# EAGLE design PreAmpAndFilter (EAGLE 7.6.0)
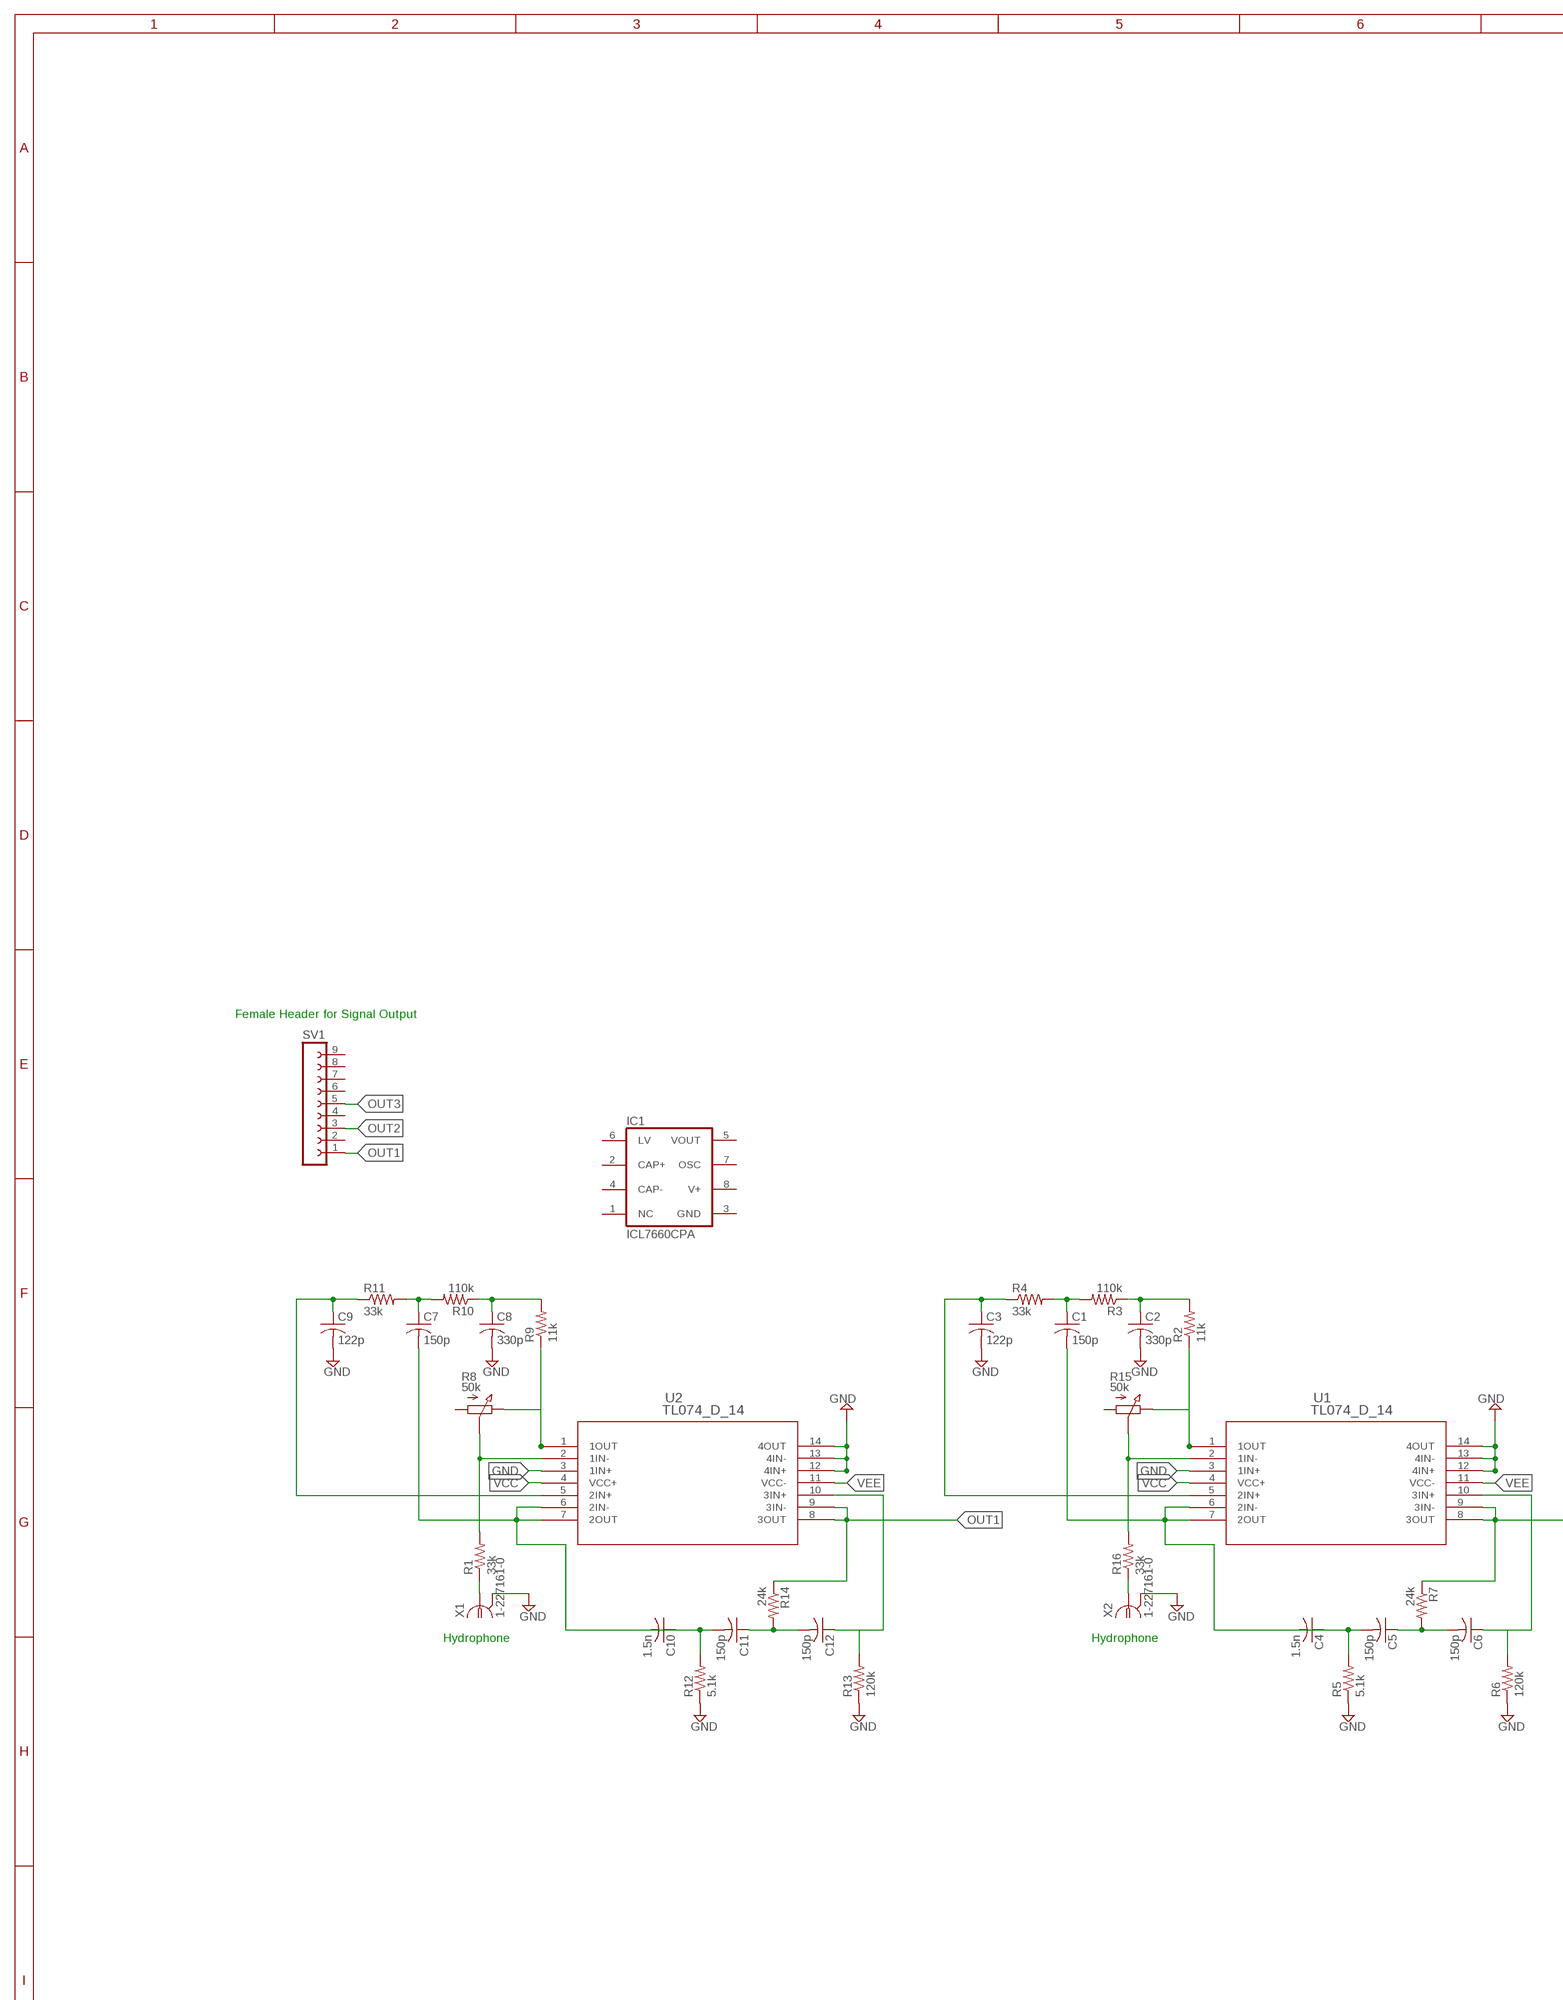
[diagram p0: schematic, sheet 1, part 1 of 2]
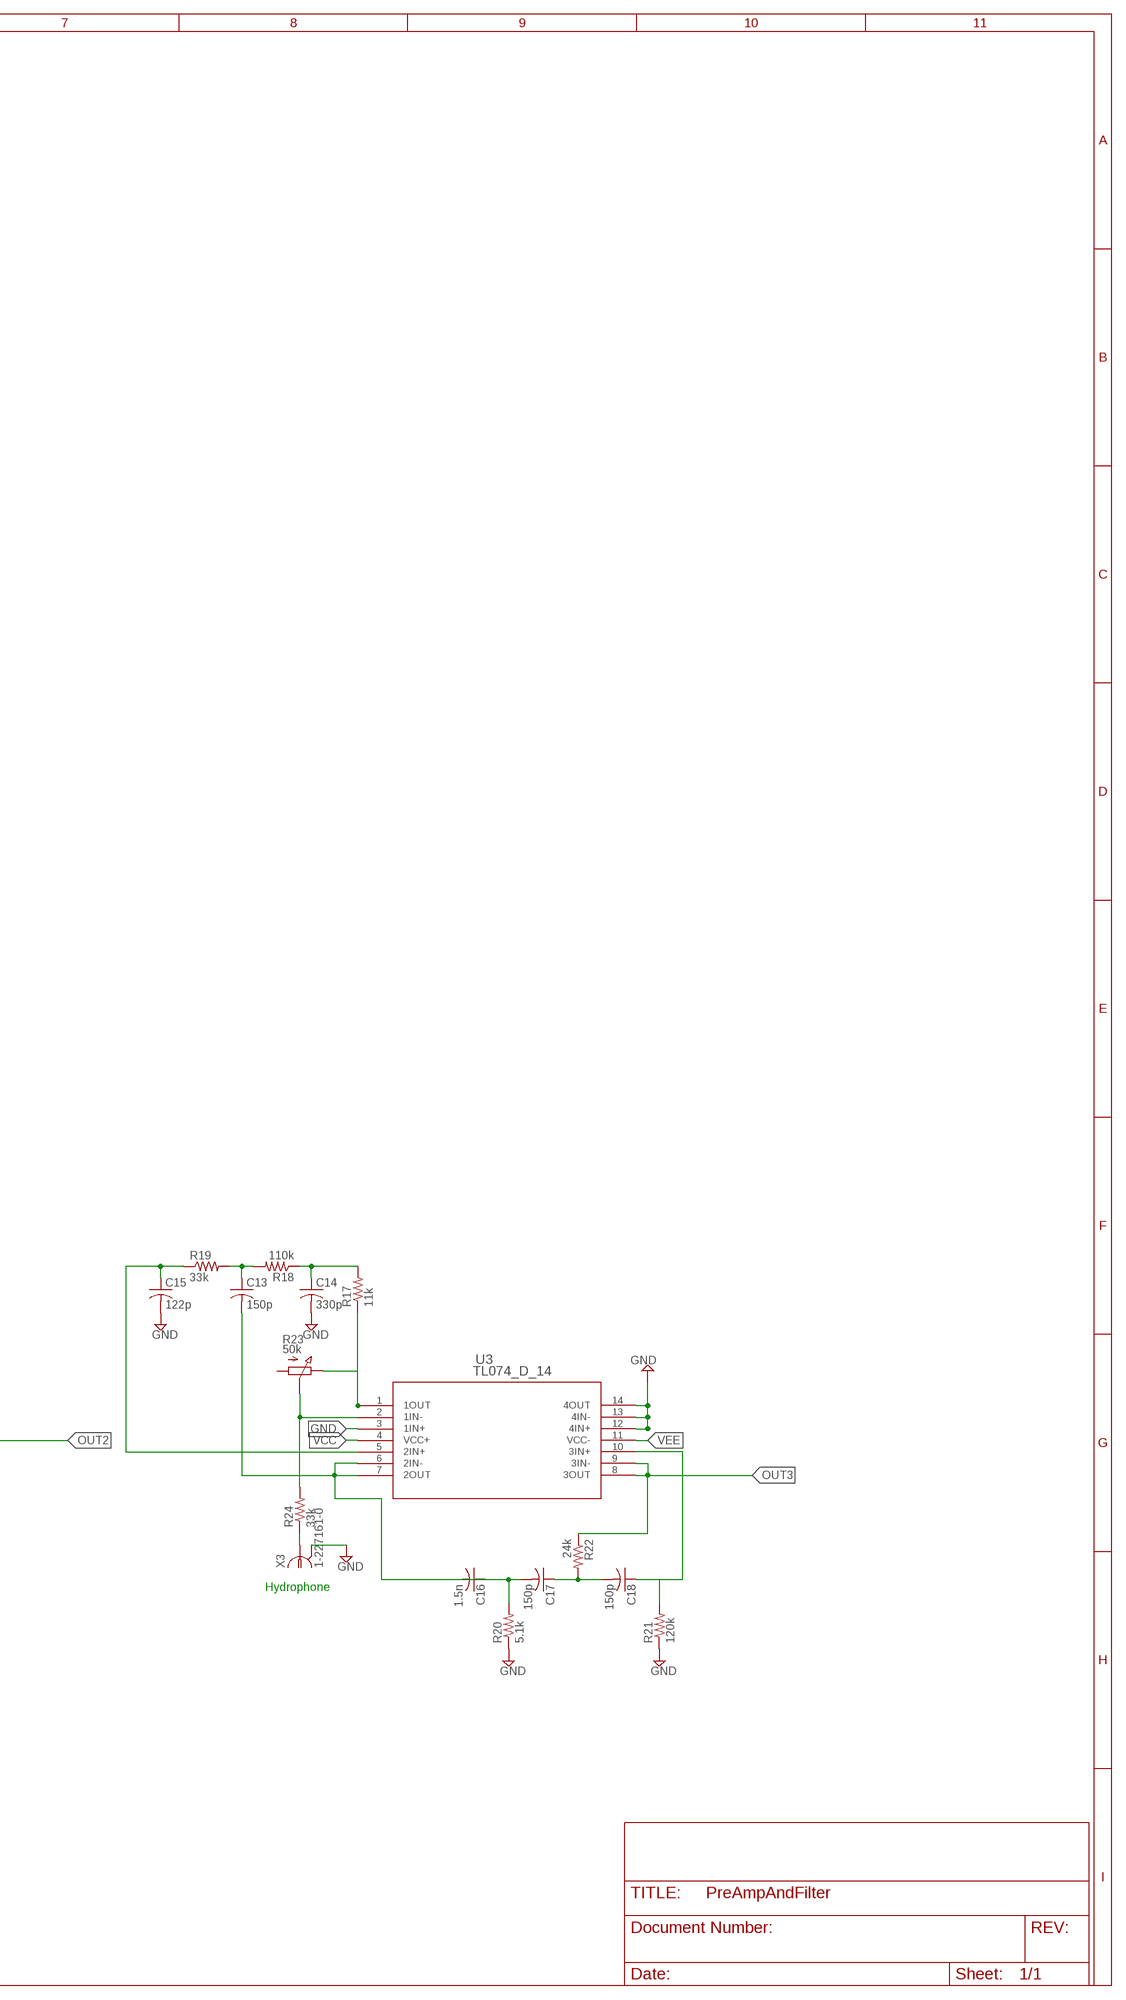
[diagram p1: schematic, sheet 1, part 2 of 2]

## Parts
C1  150p  C-US025-024X044  [C025-024X044]
C2  330p  C-US025-024X044  [C025-024X044]
C3  122p  C-US025-024X044  [C025-024X044]
C4  1.5n  C-US025-024X044  [C025-024X044]
C5  150p  C-US025-024X044  [C025-024X044]
C6  150p  C-US025-024X044  [C025-024X044]
C7  150p  C-US025-024X044  [C025-024X044]
C8  330p  C-US025-024X044  [C025-024X044]
C9  122p  C-US025-024X044  [C025-024X044]
C10  1.5n  C-US025-024X044  [C025-024X044]
C11  150p  C-US025-024X044  [C025-024X044]
C12  150p  C-US025-024X044  [C025-024X044]
C13  150p  C-US025-024X044  [C025-024X044]
C14  330p  C-US025-024X044  [C025-024X044]
C15  122p  C-US025-024X044  [C025-024X044]
C16  1.5n  C-US025-024X044  [C025-024X044]
C17  150p  C-US025-024X044  [C025-024X044]
C18  150p  C-US025-024X044  [C025-024X044]
IC1  ICL7660CPA  [DIL08]
R1  33k  R-US_0204/2V  [0204V]
R2  11k  R-US_0204/2V  [0204V]
R3  110k  R-US_0204/2V  [0204V]
R4  33k  R-US_0204/2V  [0204V]
R5  5.1k  R-US_0204/2V  [0204V]
R6  120k  R-US_0204/2V  [0204V]
R7  24k  R-US_0204/2V  [0204V]
R8  50k  PC25  [PC25]
R9  11k  R-US_0204/2V  [0204V]
R10  110k  R-US_0204/2V  [0204V]
R11  33k  R-US_0204/2V  [0204V]
R12  5.1k  R-US_0204/2V  [0204V]
R13  120k  R-US_0204/2V  [0204V]
R14  24k  R-US_0204/2V  [0204V]
R15  50k  PC25  [PC25]
R16  33k  R-US_0204/2V  [0204V]
R17  11k  R-US_0204/2V  [0204V]
R18  110k  R-US_0204/2V  [0204V]
R19  33k  R-US_0204/2V  [0204V]
R20  5.1k  R-US_0204/2V  [0204V]
R21  120k  R-US_0204/2V  [0204V]
R22  24k  R-US_0204/2V  [0204V]
R23  50k  PC25  [PC25]
R24  33k  R-US_0204/2V  [0204V]
SV1  FE09-1  [FE09]
U1  TL074_D_14  [D14]
U2  TL074_D_14  [D14]
U3  TL074_D_14  [D14]
X1  1-227161-0  [AMP_227161]
X2  1-227161-0  [AMP_227161]
X3  1-227161-0  [AMP_227161]

## Nets
GND: C2.2 C3.2 C8.2 C9.2 C14.2 C15.2 R1.2 R5.1 R6.1 R8.S R12.1 R13.1 R15.S R16.2 R20.1 R21.1 R23.S R24.2 U1.2(1IN-) U1.3(1IN+) U1.12(4IN+) U1.13(4IN-) U1.14(4OUT) U2.2(1IN-) U2.3(1IN+) U2.12(4IN+) U2.13(4IN-) U2.14(4OUT) U3.2(1IN-) U3.3(1IN+) U3.12(4IN+) U3.13(4IN-) U3.14(4OUT) X1.2 X2.2 X3.2
N$1: R1.1 X1.1
N$2: R2.1 R15.E U1.1(1OUT)
N$3: C2.1 R2.2 R3.1
N$4: C1.1 R3.2 R4.2
N$5: C1.2 C4.1 C4.2 C5.2 R5.2 U1.6(2IN-) U1.7(2OUT)
N$6: C5.1 C6.2 R7.2
N$7: R8.E R9.1 U2.1(1OUT)
N$8: C8.1 R9.2 R10.1
N$9: C7.1 R10.2 R11.2
N$10: C7.2 C10.1 C10.2 C11.2 R12.2 U2.6(2IN-) U2.7(2OUT)
N$11: C11.1 C12.2 R14.2
N$12: R16.1 X2.1
N$13: R17.1 R23.E U3.1(1OUT)
N$14: C14.1 R17.2 R18.1
N$15: C13.1 R18.2 R19.2
N$16: C13.2 C16.1 C16.2 C17.2 R20.2 U3.6(2IN-) U3.7(2OUT)
N$17: C17.1 C18.2 R22.2
N$18: R24.1 X3.1
OUT1: R14.1 SV1.1 U2.8(3OUT) U2.9(3IN-)
OUT2: R7.1 SV1.3 U1.8(3OUT) U1.9(3IN-)
OUT3: R22.1 SV1.5 U3.8(3OUT) U3.9(3IN-)
VCC: U1.4(VCC+) U2.4(VCC+) U3.4(VCC+)
VCC+: C9.1 R11.1 U2.5(2IN+)
VCC+1: C3.1 R4.1 U1.5(2IN+)
VCC+2: C15.1 R19.1 U3.5(2IN+)
VCC-: C12.1 R13.2 U2.10(3IN+)
VCC-1: C6.1 R6.2 U1.10(3IN+)
VCC-2: C18.1 R21.2 U3.10(3IN+)
VEE: U1.11(VCC-) U2.11(VCC-) U3.11(VCC-)
Unconnected: IC1.1(NC) IC1.2(CAP+) IC1.4(CAP-) IC1.5(VOUT) IC1.6(LV) IC1.7(OSC) R8.A R15.A R23.A SV1.2 SV1.4 SV1.6 SV1.7 SV1.8 SV1.9

## Notes on the sheet
- Female Header for Signal Output
- Hydrophone | Hydrophone
- Hydrophone

## Power pins joined to a net without a drawn wire
GND: IC1.3(GND)
V+: IC1.8(V+)

## Library data of the parts
C1-C18 = resistor:C-US: CAPACITOR, American symbol
IC1 = maxim:ICL7660CPA: VOLTAGE CONVERTER; MF: INTERSIL; MPN: ICL7660CPA; OC_FARNELL: 1018170; OC_NEWARK: 06F7441
R1-R7 R9-R14 R16-R22 R24 = resistor:R-US_: RESISTOR, American symbol
R8 R15 R23 = pot-vitrohm:PC25: VITROHM POTENTIOMETER; MF: CLAROSTAT; MPN: 308NPC25KS; OC_FARNELL: 1440998; OC_NEWARK: 03F7518
SV1 = con-lsta:FE09-1: FEMALE HEADER; OC_FARNELL: unknown; OC_NEWARK: unknown
U1-U3 = TL074_D:TL074_D_14; DATASHEETURL: httpwww.ti.comlitgpnTL074; FAMILY_NAME: STANDARD LINEAR AMPLIFIER; GENERIC_PART_NUMBER: TL074; INDUSTRY_STD_PKG_TYPE: SOIC; MANUFACTURER: Texas Instruments; PACKAGE_DESIGNATOR: D; PIN_COUNT: 14
X1-X3 = con-coax:?227161*: JACK, RIGHT ANGLE, 50 OHM, PCB, BNC Source: amp_227161.pdf; MF: TYCO ELECTRONICS; MPN: 1-227161; OC_FARNELL: unknown; OC_NEWARK: 33B3200

## Board
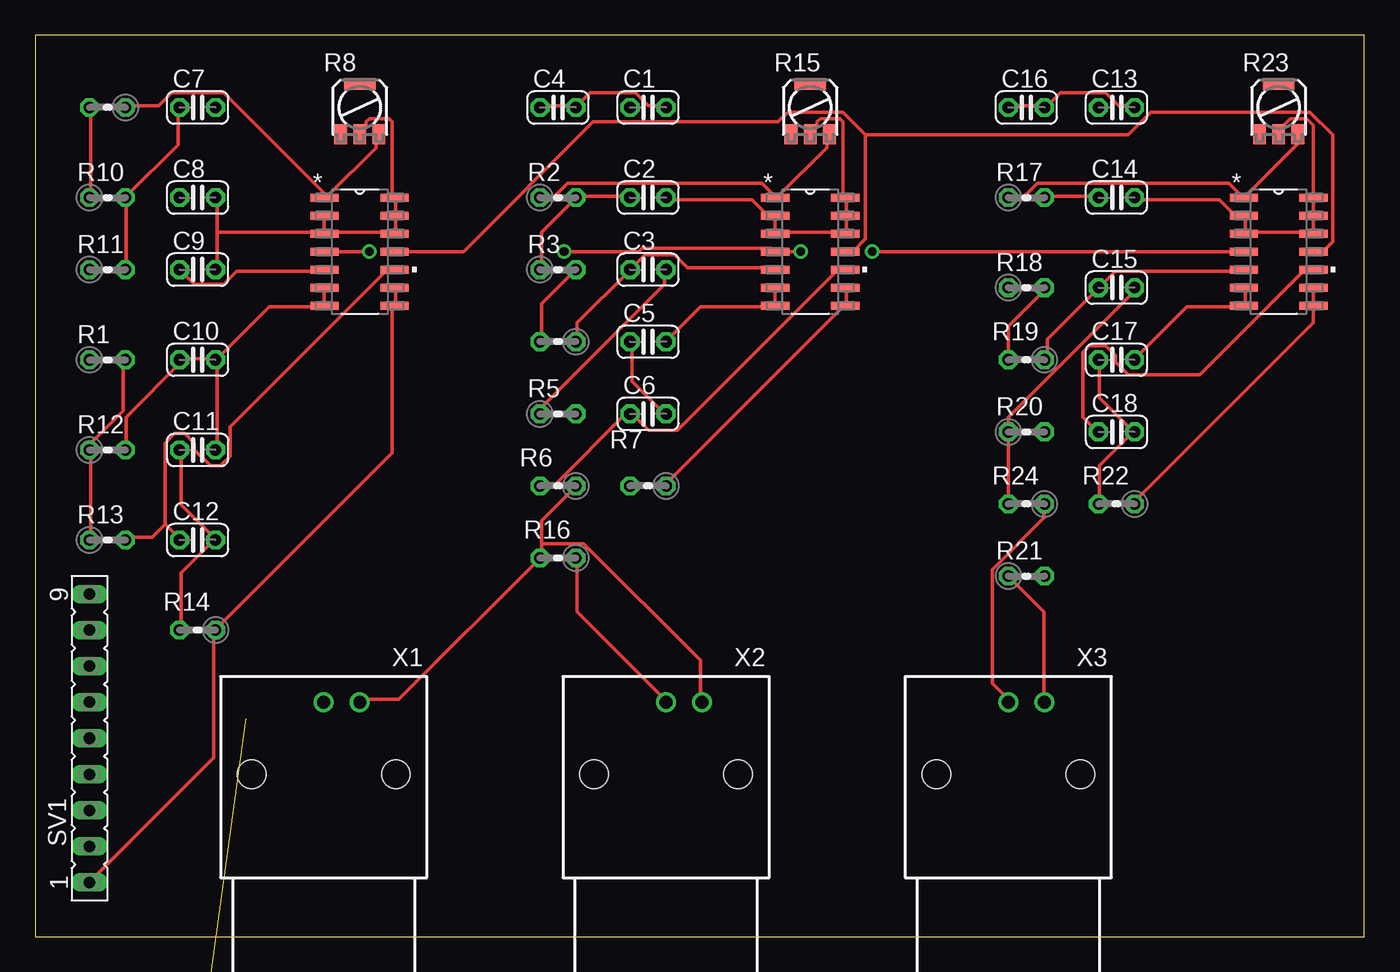
[diagram p2: board, top side]
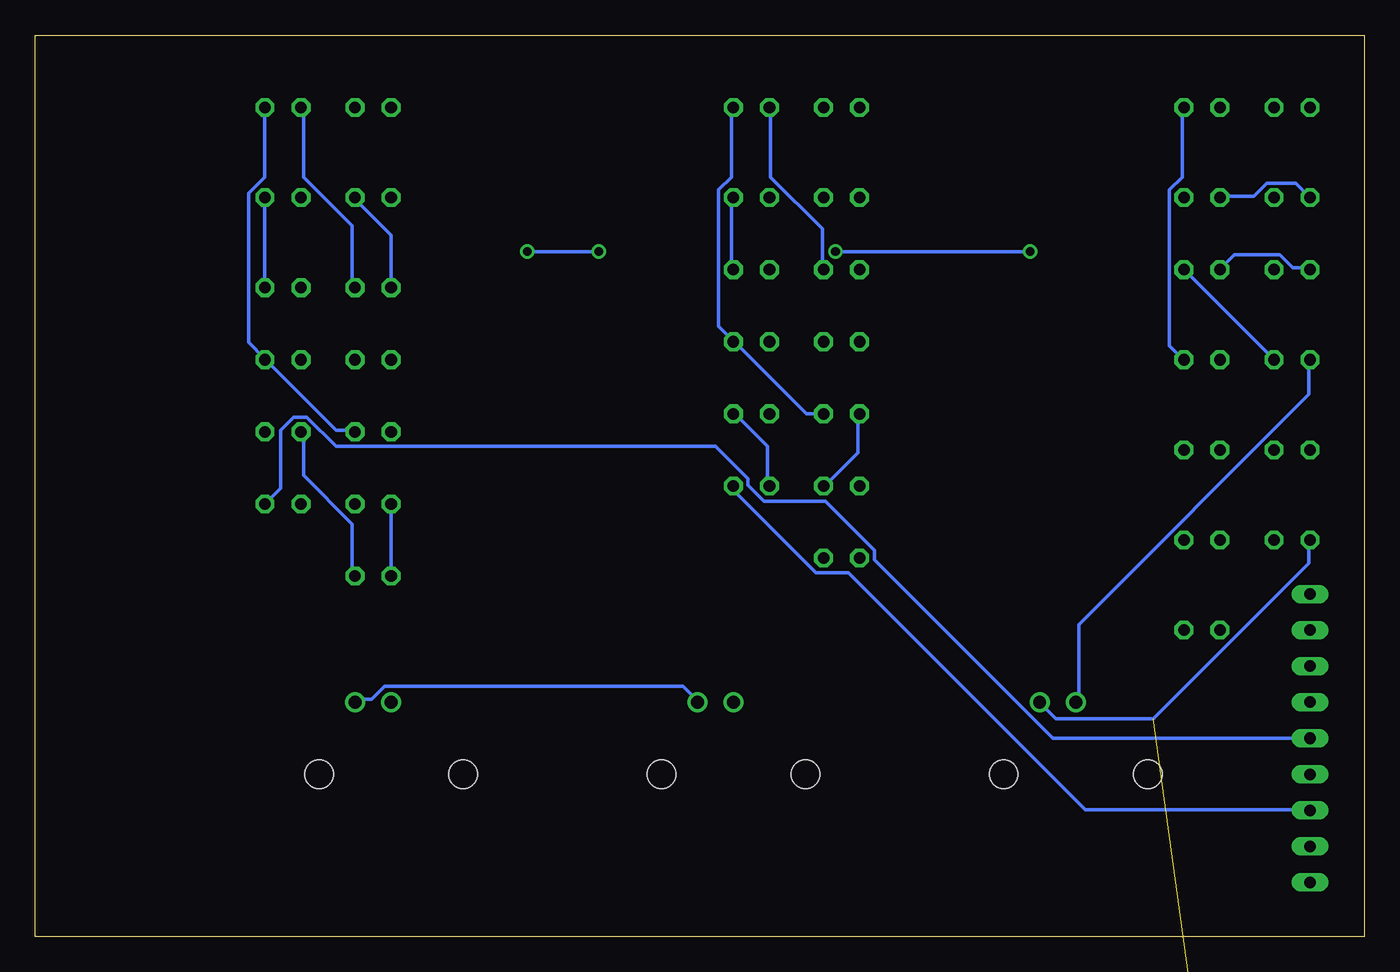
[diagram p3: board, bottom side, seen from below]

Size 93.65 x 63.49 mm. Coordinates in mm from the lower left corner, seen from the top.
Outline: 0,0 93.65,0 93.65,63.49 0,63.49 0,0
Copper layers (1*16): Top 0.035mm / dielectric 1.5mm / Bottom 0.035mm
Design rules "default": minimum track width 10mil, minimum drill 24mil, track to track 8mil, track to pad 8mil, pad to pad 8mil, via to via 8mil, smd to smd 8mil, copper to edge 40mil, drill to drill 8mil, minimum pad ring 10mil, minimum via ring 8mil, stop-mask expansion 4mil, vias tented up to drill 0mil, thermal gap 10mil

### Footprints (pad centres in the part's own frame; a part is rotated, then mirrored left to right if it is on the bottom)
C025-024X044 = drill 0.813 octagon: 1 -1.27,0; 2 1.27,0
DIL08 = drill 0.813 long: 1 -3.81,-3.81; 2 -1.27,-3.81; 3 1.27,-3.81; 4 3.81,-3.81; 5 3.81,3.81; 6 1.27,3.81; 7 -1.27,3.81; 8 -3.81,3.81
0204V = drill 0.813 octagon: 1 -1.27,0; 2 1.27,0
PC25 = smd 2.2 x 0.8: 4 0,1.65 | smd 0.9 x 1.4: A -1.35,-1.9; E 1.35,-1.9; S 0,-1.9
FE09 = drill 0.813 long: 1 -10.16,0; 2 -7.62,0; 3 -5.08,0; 4 -2.54,0; 5 0,0; 6 2.54,0; 7 5.08,0; 8 7.62,0; 9 10.16,0
D14 = smd 1.981 x 0.559: 1 -2.464,3.81; 2 -2.464,2.54; 3 -2.464,1.27; 4 -2.464,0; 5 -2.464,-1.27; 6 -2.464,-2.54; 7 -2.464,-3.81; 8 2.464,-3.81; 9 2.464,-2.54; 10 2.464,-1.27; 11 2.464,0; 12 2.464,1.27; 13 2.464,2.54; 14 2.464,3.81
AMP_227161 = drill 0.9 pad 1.27: 1 0,-5.08; 2 -2.54,-5.08 | hole 2: -5.08,0; 5.08,0

### Placement (x,y rotation side)
C1  43.18,58.42 0 top
C2  43.18,52.07 0 top
C3  43.18,46.99 0 top
C4  36.83,58.42 0 top
C5  43.18,41.91 0 top
C6  43.18,36.83 0 top
C7  11.43,58.42 0 top
C8  11.43,52.07 0 top
C9  11.43,46.99 0 top
C10  11.43,40.64 0 top
C11  11.43,34.29 0 top
C12  11.43,27.94 0 top
C13  76.2,58.42 0 top
C14  76.2,52.07 0 top
C15  76.2,45.72 0 top
C16  69.85,58.42 0 top
C17  76.2,40.64 0 top
C18  76.2,35.56 0 top
IC1  7.62,-24.13 0 top  (outside the outline)
R1  5.08,40.64 0 top
R2  36.83,52.07 0 top
R3  36.83,46.99 0 top
R4  36.83,41.91 180 top
R5  36.83,36.83 0 top
R6  36.83,31.75 180 top
R7  43.18,31.75 180 top
R8  22.86,58.42 0 top
R9  5.08,58.42 180 top
R10  5.08,52.07 0 top
R11  5.08,46.99 0 top
R12  5.08,34.29 0 top
R13  5.08,27.94 0 top
R14  11.43,21.59 180 top
R15  54.61,58.42 0 top
R16  36.83,26.67 180 top
R17  69.85,52.07 0 top
R18  69.85,45.72 0 top
R19  69.85,40.64 180 top
R20  69.85,35.56 0 top
R21  69.85,25.4 0 top
R22  76.2,30.48 180 top
R23  87.63,58.42 0 top
R24  69.85,30.48 180 top
SV1  3.81,13.97 90 top
U1  54.61,48.26 0 top
U2  22.86,48.26 0 top
U3  87.63,48.26 0 top
X1  20.32,11.43 180 top
X2  44.45,11.43 180 top
X3  68.58,11.43 180 top

### Tracks (layer width: path | path; a pad name or v marks a point on that pad's centre or on a via)
GND  (1 unrouted)
  Top 0.254: R24.2 R20.1 68.58,36.6 77.5,45.52 C15.2 | R21.1 71.09,22.88 71.09,16.71 X3.2 | 85.27,49.63 85.27,50.77 U3.2 85.04,51 84.35,51 83.44,51.92 77.5,51.92 C14.2 | 90.07,49.63 90.07,50.77 U3.13 90.07,51 90.07,51.92 U3.14 90.07,52.15 90.07,57.17 89.61,57.63 88.47,57.63 87.78,56.95 87.78,56.72 R23.S | 90.07,49.63 85.27,49.63 | 85.27,49.63 U3.3 | 90.07,49.63 U3.12 | R13.1 3.89,28.14 3.89,34.09 R12.1 3.89,34.31 3.89,34.77 6.17,37.06 6.17,40.49 R1.2 | 12.8,49.63 12.8,51.92 C8.2 | 12.8,49.63 12.8,47.12 C9.2 | 20.34,49.63 20.34,50.77 U2.2 | R8.S 22.86,56.72 23.32,57.17 23.32,57.4 23.55,57.63 24.92,57.63 25.15,57.4 25.15,52.15 U2.14 25.38,51.92 25.38,51 U2.13 25.38,50.77 25.38,49.63 U2.12 25.15,49.63 20.57,49.63 U2.3 20.34,49.63 | 20.34,49.63 12.8,49.63 | R15.S 54.63,56.72 55.09,57.17 55.09,57.4 55.32,57.63 56.69,57.63 56.92,57.4 56.92,52.15 U1.14 57.15,51.92 57.15,51 U1.13 57.15,50.77 57.15,49.63 U1.12 56.92,49.63 52.35,49.63 U1.3 52.12,49.63 52.12,50.77 U1.2 52.12,51 51.44,51 50.52,51.92 44.58,51.92 C2.2 | 35.66,27.69 35.66,29.29 37.95,31.57 R6.1 | 35.66,27.69 35.66,26.77 R16.2 25.6,16.71 22.86,16.71 X1.2 | 35.66,27.69 38.63,27.69 46.86,19.46 46.86,16.71 X2.2 | C3.2 44.35,46.89 44.35,45.97 35.66,37.29 35.66,36.83 R5.1
  Bottom 0.254: R24.2 R21.1 | C15.2 77.5,45.74 77.5,51.92 C14.2 | R1.2 6.4,40.72 12.57,46.89 C9.2 | C3.2 44.58,47.12 44.58,51.92 C2.2 | R5.1 35.66,36.83 35.66,34.09 37.95,31.8 R6.1 | R13.1 3.89,27.91 3.89,26.31 14.86,15.34 21.72,15.34 22.86,16.48 X1.2 | X3.2 71.09,16.71 69.95,16.71 69.04,17.63 48.01,17.63 47.09,16.71 X2.2
N$1
  Bottom 0.254: R1.1 3.89,40.49 3.89,38.2 20.12,21.97 20.12,16.71 X1.1
N$2
  Top 0.254: R15.E 55.78,56.49 55.78,55.57 52.35,52.15 U1.1 52.12,52.15 51.21,53.06 37.49,53.06 36.58,52.15 35.66,52.15 R2.1
N$3
  Top 0.254: R3.1 35.66,47.12 35.66,49.63 R2.2 38.18,52.15 41.83,52.15 C2.1
N$4
  Top 0.254: R4.2 35.66,42.09 35.66,44.6 37.95,46.89 R3.2
  Bottom 0.254: C1.1 41.83,58.32 41.83,53.52 38.18,49.86 38.18,47.12 R3.2
N$5
  Top 0.254: C4.1 35.66,58.55 37.95,58.55 C4.2 38.18,58.55 39.09,59.46 42.29,59.46 43.2,58.55 44.35,58.55 C1.2 | U1.6 52.12,45.52 52.12,44.6 U1.7 52.12,44.37 46.86,44.37 44.58,42.09 C5.2
  Bottom 0.254: R5.2 39.32,36.83 44.35,41.86 C5.2 44.58,42.09 45.49,43 45.49,52.6 44.58,53.52 44.58,58.32 C1.2
N$6
  Top 0.254: C5.1 42.06,41.86 42.06,39.12 44.35,36.83 C6.2
  Bottom 0.254: R7.2 42.06,31.8 42.06,34.54 44.35,36.83 C6.2
N$7
  Top 0.254: 20.57,52.15 24,55.57 24,56.49 R8.E | 20.57,52.15 13.26,59.46 9.6,59.46 8.69,58.55 6.4,58.55 R9.1 | 20.57,52.15 U2.1
N$8
  Top 0.254: R10.1 3.89,52.15 3.89,58.32 R9.2
  Bottom 0.254: R10.1 4.8,53.06 6.86,53.06 7.77,52.15 10.06,52.15 C8.1
N$9
  Top 0.254: R11.2 6.4,47.12 6.4,51.92 R10.2 6.4,52.15 10.06,55.8 10.06,58.32 C7.1
N$10
  Top 0.254: R12.2 6.4,34.31 6.4,36.6 10.29,40.49 C10.1 10.29,40.72 12.57,40.72 C10.2 | U2.6 20.34,45.52 20.34,44.6 U2.7 20.34,44.37 16.46,44.37 12.8,40.72 C10.2 | C11.2 12.8,34.31 12.8,40.49 C10.2
  Bottom 0.254: C7.2 12.8,58.32 12.8,53.52 13.72,52.6 13.72,41.63 12.8,40.72 C10.2
N$11
  Top 0.254: R14.2 10.29,21.74 10.29,25.63 12.57,27.91 C12.2 12.57,28.14 10.29,30.43 10.29,34.09 C11.1
N$12
  Top 0.254: R16.1 38.18,26.54 38.18,22.88 44.35,16.71 X2.1
N$13
  Top 0.254: R23.E 88.92,56.49 88.92,55.8 85.27,52.15 U3.1 85.04,52.15 84.12,53.06 70.64,53.06 69.72,52.15 68.58,52.15 R17.1
N$14
  Top 0.254: C14.1 74.75,52.15 71.32,52.15 R17.2
  Bottom 0.254: R18.1 68.58,49.4 71.09,51.92 R17.2
N$15
  Top 0.254: R19.2 68.58,43 71.09,45.52 R18.2
  Bottom 0.254: C13.1 74.75,58.32 74.75,53.52 71.32,50.09 71.32,45.74 R18.2
N$16
  Top 0.254: C16.1 68.58,58.55 71.09,58.55 C16.2 71.32,58.55 72.24,59.46 75.44,59.46 76.35,58.55 77.27,58.55 C13.2 | U3.6 85.27,45.52 85.27,44.6 U3.7 85.04,44.37 81.15,44.37 77.5,40.72 C17.2
  Bottom 0.254: R20.2 71.32,35.69 72.47,35.69 77.27,40.49 C17.2 77.5,40.72 78.64,41.86 78.64,52.38 77.5,53.52 77.5,58.32 C13.2
N$17
  Top 0.254: R22.2 74.98,30.66 74.98,33.17 77.27,35.46 C18.2 77.27,35.69 74.98,37.97 74.98,40.49 C17.1
N$18
  Top 0.254: R24.1 71.09,30.43 71.09,29.52 67.44,25.86 67.44,17.86 68.58,16.71 X3.1
OUT1
  Top 0.254: U2.9 25.38,45.52 25.38,44.6 U2.8 25.15,44.37 25.15,34.09 12.8,21.74 R14.1 12.57,21.51 12.57,12.6 3.89,3.91 SV1.1
OUT2
  Top 0.254: U1.9 57.15,45.52 57.15,44.6 U1.8 56.92,44.37 44.35,31.8 R7.1
  Bottom 0.254: SV1.3 3.89,8.94 19.66,8.94 36.35,25.63 38.63,25.63 44.58,31.57 R7.1
OUT3
  Top 0.254: U3.9 90.07,45.52 90.07,44.6 U3.8 90.07,44.37 90.07,43.23 77.5,30.66 R22.1
  Bottom 0.254: SV1.5 21.95,13.97 34.52,26.54 34.52,27.23 37.95,30.66 42.29,30.66 43.43,31.8 43.43,32.26 45.72,34.54 72.47,34.54 74.52,36.6 75.44,36.6 76.35,35.69 76.35,31.57 77.27,30.66 R22.1
VCC  (via drill 0.61)
  Top 0.254: v23.55,48.26 U2.4 | v37.26,48.26 42.52,48.26 42.75,48.49 51.89,48.49 52.12,48.26 U1.4 v53.95,48.26 | v58.98,48.26 U3.4
  Bottom 0.254: v37.26,48.26 v23.55,48.26 | v53.95,48.26 v58.98,48.26
VCC+
  Top 0.254: U2.5 20.34,46.89 14.17,46.89 13.26,45.97 11.2,45.97 10.29,46.89 C9.1
  Bottom 0.254: R11.1 3.89,47.12 5.03,47.12 5.94,48.03 9.14,48.03 10.06,47.12 C9.1
VCC+1
  Top 0.254: U1.5 52.12,47.12 45.95,47.12 45.03,48.03 42.98,48.03 42.06,47.12 C3.1 41.83,46.89 38.18,43.23 38.18,42.09 R4.1
VCC+2
  Top 0.254: U3.5 85.04,46.89 76.12,46.89 74.98,45.74 C15.1 74.75,45.52 71.32,42.09 71.32,40.72 R19.1
VCC-
  Top 0.254: 9.14,29.06 9.14,34.77 9.83,35.46 10.52,35.46 11.2,34.77 11.2,34.31 12.34,33.17 13.03,33.17 13.72,33.86 13.72,35.92 24.69,46.89 25.15,46.89 U2.10 | 9.14,29.06 10.06,28.14 C12.1 | 9.14,29.06 8.23,28.14 6.4,28.14 R13.2
VCC-1
  Top 0.254: U1.10 56.92,46.89 56.46,46.89 45.26,35.69 43.2,35.69 42.06,36.83 C6.1 41.6,36.83 36.58,31.8 35.66,31.8 R6.2
VCC-2
  Top 0.254: U3.10 90.07,46.89 89.38,46.89 82.07,39.57 77.04,39.57 76.12,40.49 76.12,40.95 75.44,41.63 74.3,41.63 73.84,41.17 73.84,36.6 74.75,35.69 C18.1
  Bottom 0.254: R21.2 71.32,25.4 71.32,29.06 74.75,32.49 74.75,35.46 C18.1
VEE
  Top 0.254: U2.11 30.18,48.26 39.32,57.4 52.35,57.4 53.03,58.09 56.92,58.09 58.52,56.49 | 58.52,56.49 58.52,49.17 57.61,48.26 U1.11 | U3.11 90.75,48.26 91.44,48.95 91.44,56.49 89.84,58.09 78.64,58.09 77.04,56.49 58.52,56.49